# EAGLE design MINI_Sam_2016_10_24_002 (EAGLE 7.6.0)
DESIGNER: BENJAMIN SHOCKLEY; REV: A
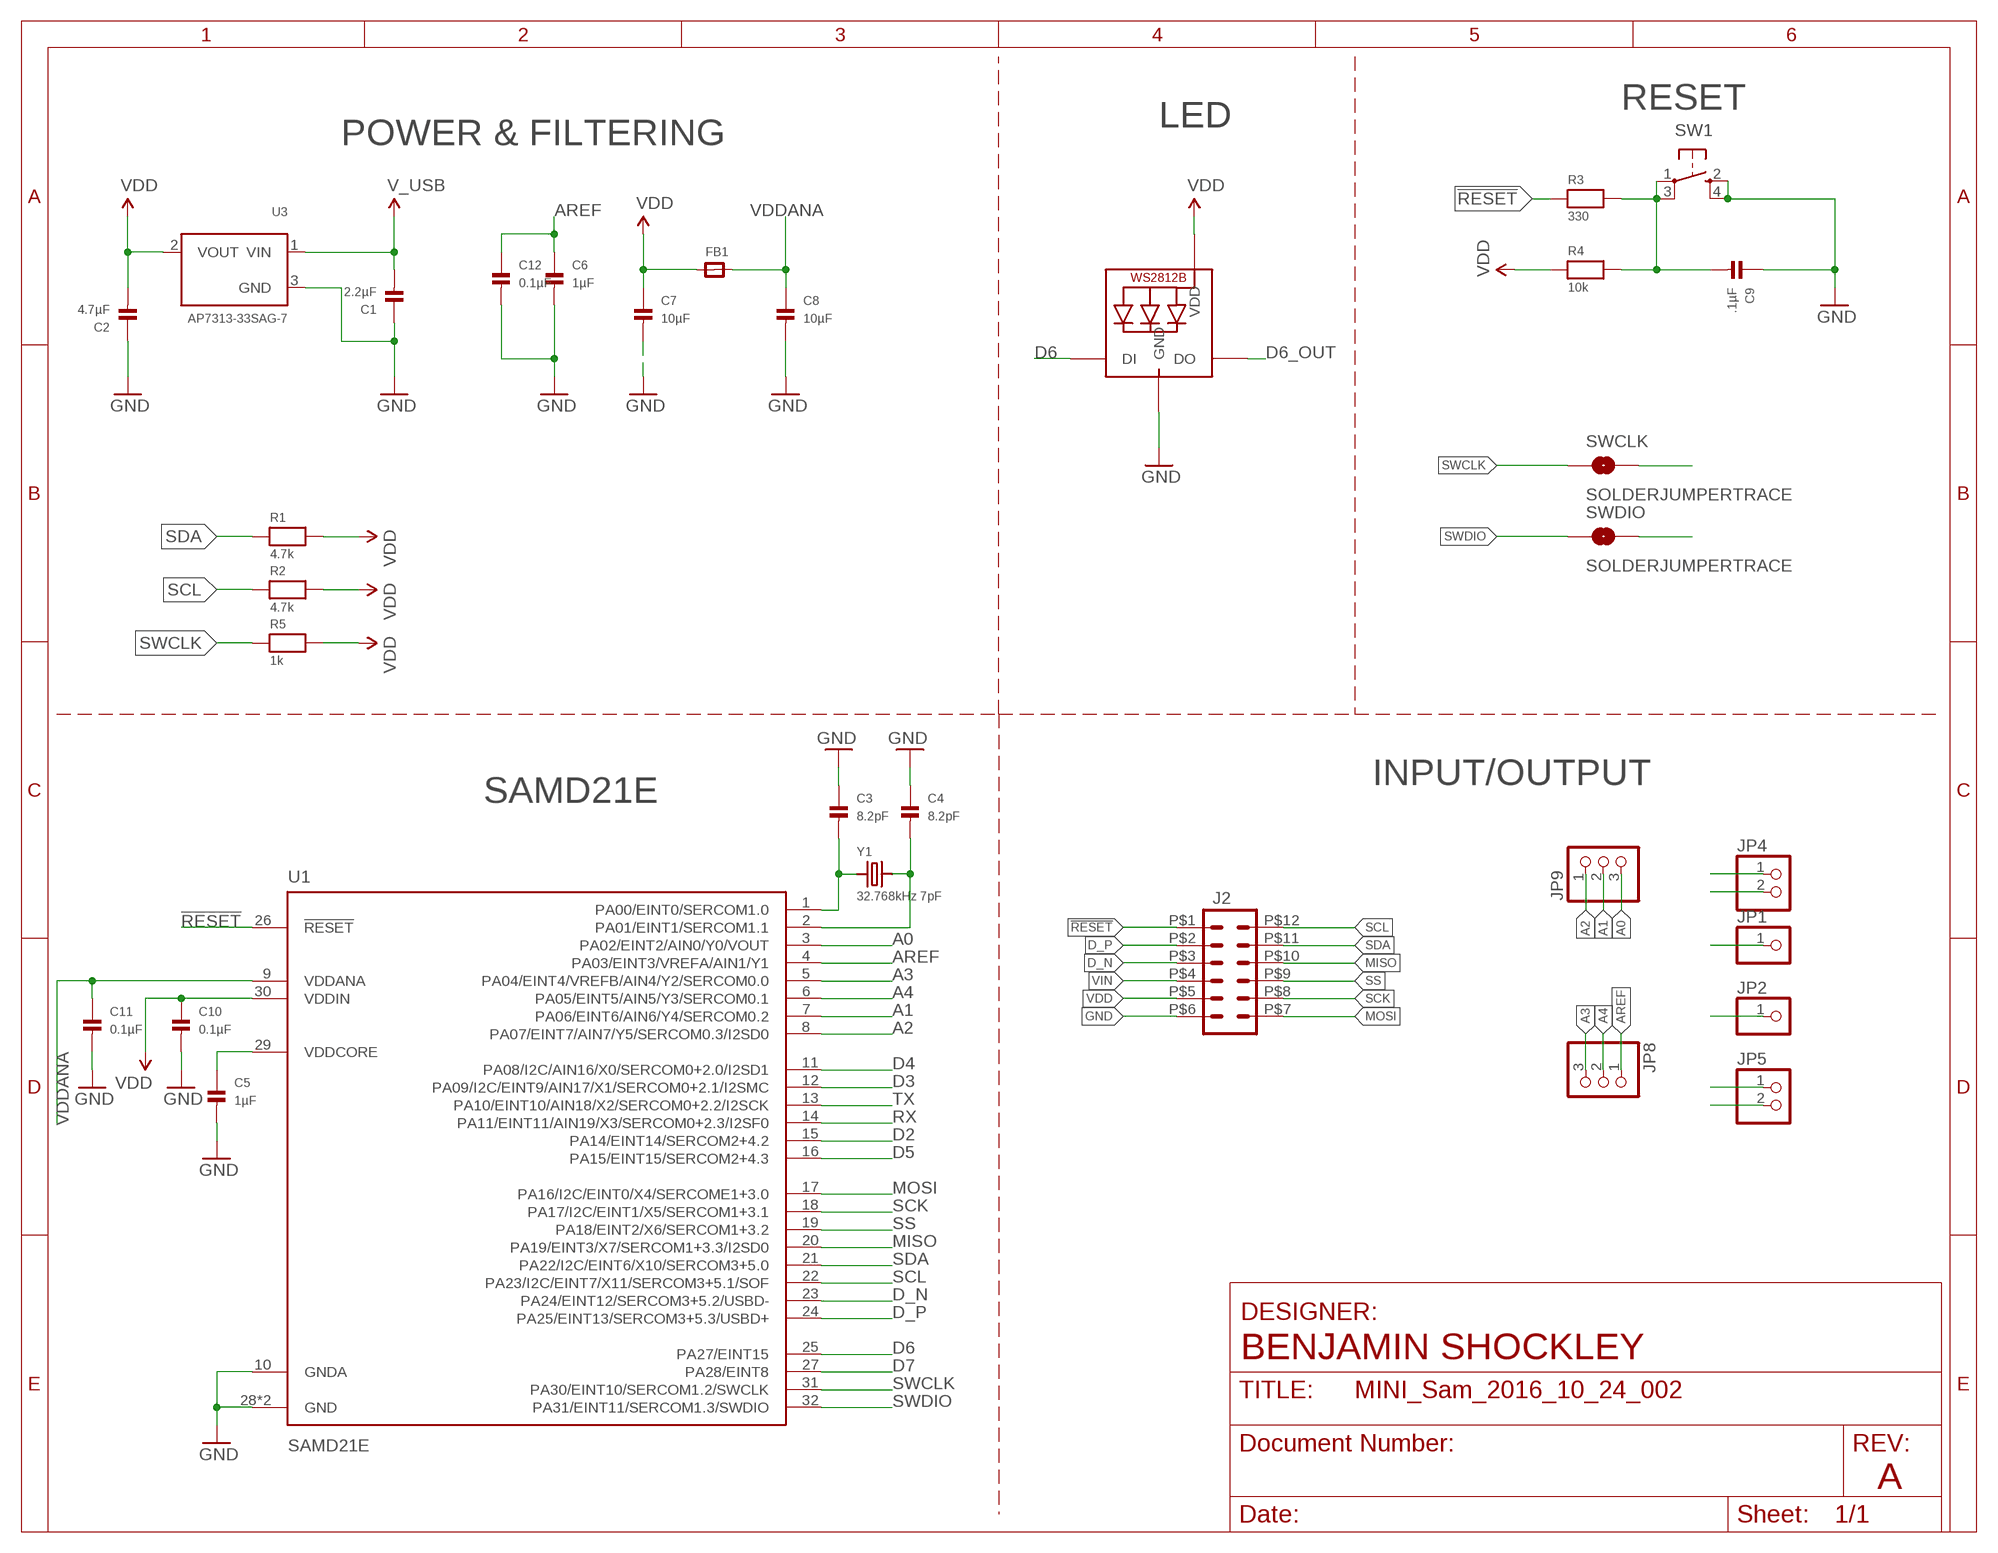
[diagram p0: schematic, sheet 1]

## Parts
C1  2.2µF  CAP_CERAMIC_0805MP  [_0805MP]
C2  4.7µF  CAP_CERAMIC_0805MP  [_0805MP]
C3  8.2pF  CAP_CERAMIC_0805MP  [_0805MP]
C4  8.2pF  CAP_CERAMIC_0805MP  [_0805MP]
C5  1µF  CAP_CERAMIC_0805MP  [_0805MP]
C6  1µF  CAP_CERAMIC_0805MP  [_0805MP]
C7  10µF  CAP_CERAMIC_0805MP  [_0805MP]
C8  10µF  CAP_CERAMIC_0805MP  [_0805MP]
C9  .1µF  CAP_CERAMIC_0805MP  [_0805MP]
C10  0.1µF  CAP_CERAMIC_0805MP  [_0805MP]
C11  0.1µF  CAP_CERAMIC_0805MP  [_0805MP]
C12  0.1µF  CAP_CERAMIC_0805MP  [_0805MP]
FB1  FERRITE_0805MP  [_0805MP]
J2  M06X2  [2MMDUALROW]
JP1  HEADER-1X1ROUND  [1X01_ROUND]
JP2  HEADER-1X1ROUND  [1X01_ROUND]
JP4  HEADER-1X2ROUND  [1X02_ROUND]
JP5  HEADER-1X2ROUND  [1X02_ROUND]
JP8  HEADER-1X3ROUND  [1X03_ROUND]
JP9  HEADER-1X3ROUND  [1X03_ROUND]
LED  WS2812B3535  [LED3535]
R1  4.7k  RESISTOR_0805MP  [_0805MP]
R2  4.7k  RESISTOR_0805MP  [_0805MP]
R3  330  RESISTOR_0805MP  [_0805MP]
R4  10k  RESISTOR_0805MP  [_0805MP]
R5  1k  RESISTOR_0805MP  [_0805MP]
SW1  SPST_TACT-KMR2  [KMR2]
SWCLK  SOLDERJUMPERTRACE  [SJ_2S-TRACE]
SWDIO  SOLDERJUMPERTRACE  [SJ_2S-TRACE]
U1  SAMD21E  [QFN32]
U3  AP7313-33SAG-7  VREG_SOT23  [SOT23-R]
Y1  32.768kHz 7pF  CRYSTAL0805PACKAGE  [_0805MP]

## Nets
!RESET: J2.P$1 R3.1 U1.26(!RESET)
A0: JP9.3 U1.3(PA02/EINT2/AIN0/Y0/VOUT)
A1: JP9.2 U1.7(PA06/EINT6/AIN6/Y4/SERCOM0.2)
A2: JP9.1 U1.8(PA07/EINT7/AIN7/Y5/SERCOM0.3/I2SD0)
A3: JP8.3 U1.5(PA04/EINT4/VREFB/AIN4/Y2/SERCOM0.0)
A4: JP8.2 U1.6(PA05/EINT5/AIN5/Y3/SERCOM0.1)
AREF: C6.1 C12.1 JP8.1 U1.4(PA03/EINT3/VREFA/AIN1/Y1)
D2: JP1.1 U1.15(PA14/EINT14/SERCOM2+4.2)
D3: JP2.1 U1.12(PA09/I2C/EINT9/AIN17/X1/SERCOM0+2.1/I2SMC)
D4: JP5.1 U1.11(PA08/I2C/AIN16/X0/SERCOM0+2.0/I2SD1)
D5: JP5.2 U1.16(PA15/EINT15/SERCOM2+4.3)
D6: LED.1(DI) U1.25(PA27/EINT15)
D6_OUT: LED.3(DO)
D7: U1.27(PA28/EINT8)
D_N [USB_DATA]: J2.P$3 SWDIO.2 U1.23(PA24/EINT12/SERCOM3+5.2/USBD-)
D_P [USB_DATA]: J2.P$2 SWCLK.2 U1.24(PA25/EINT13/SERCOM3+5.3/USBD+)
GND: C1.1 C2.1 C3.1 C4.1 C5.2 C6.2 C7.2 C8.2 C9.1 C10.2 C11.2 C12.2 J2.P$6 LED.4(GND) SW1.2(S) SW1.4(S1) U1.10(GNDA) U1.28(GND) U1.GND U3.3(GND)
MISO: J2.P$10 U1.20(PA19/EINT3/X7/SERCOM1+3.3/I2SD0)
MOSI: J2.P$7 U1.17(PA16/I2C/EINT0/X4/SERCOME1+3.0)
N$1: C3.2 U1.1(PA00/EINT0/SERCOM1.0) Y1.1
N$2: C9.2 R3.2 R4.2 SW1.1(P) SW1.3(P1)
N$5: C4.2 U1.2(PA01/EINT1/SERCOM1.1) Y1.2
N$9: C5.1 U1.29(VDDCORE)
RX: JP4.1 U1.14(PA11/EINT11/AIN19/X3/SERCOM0+2.3/I2SF0)
SCK: J2.P$8 U1.18(PA17/I2C/EINT1/X5/SERCOM1+3.1)
SCL: J2.P$12 R2.1 U1.22(PA23/I2C/EINT7/X11/SERCOM3+5.1/SOF)
SDA: J2.P$11 R1.1 U1.21(PA22/I2C/EINT6/X10/SERCOM3+5.0)
SS: J2.P$9 U1.19(PA18/EINT2/X6/SERCOM1+3.2)
SWCLK: R5.1 SWCLK.1 U1.31(PA30/EINT10/SERCOM1.2/SWCLK)
SWDIO: SWDIO.1 U1.32(PA31/EINT11/SERCOM1.3/SWDIO)
TX: JP4.2 U1.13(PA10/EINT10/AIN18/X2/SERCOM0+2.2/I2SCK)
VDD: C2.2 C7.1 C10.1 FB1.1 J2.P$5 LED.2(VDD) R1.2 R2.2 R4.1 R5.2 U1.30(VDDIN) U3.2(VOUT)
VDDANA: C8.1 C11.1 FB1.2 U1.9(VDDANA)
VIN: C1.2 J2.P$4 U3.1(VIN) ; supply symbol labelled V_USB

## Notes on the sheet
- RESET
- LED
- POWER & FILTERING
- INPUT/OUTPUT
- SAMD21E
- DESIGNER:

## Library data of the parts
C1-C12 = microbuilder:CAP_CERAMIC: Ceramic Capacitors 0402 - 0402 Surface Mount Capacitors 16pF 50V 5% [Digikey: 445-4899-2-ND] 18pF 50V 5% [Digikey: 490-1281-2-ND] 22pF 50V 5% [Digikey: 490-1283-2-ND] 68pF 50V 5% [Digikey: 490-1289-2-ND] 0.1uF 10V 10% [Digikey: 490-1318-2-ND] 1.0uF 6.3V 10% [Digikey: 490-1320-2-ND] 0603 - 0603 Surface Mount Capacitors 16 pF 50V 5% [Digikey: 445-5051-2-ND] 22 pF 50V [Digikey: PCC220ACVTR-ND] 33 pF 50V 5% [Digikey: 490-1415-1-ND] 56pF 50V 5% [Digikey: 490-1421-1-ND] 220pF 50V 5% [Digikey: 445-1285-1-ND] 680 pF 50V 2200 pF 50V 5% C0G [Digikey: 445-1297-1-ND] 5600 pF 100V 5% X7R [Digikey: 478-3711-1-ND] 0.1 µF 25V 10% [Digikey: PCC2277TR-ND] 0.22 µF 16V 10% X7R [Digikey: 445-1318-1-ND] 1.0 µF 25V 10% [Digikey: 445-5146-2-ND] 0603 - RF Specific 3pF 250V +/-0.1pF RF [Digikey: 712-1347-1-ND] 18 pF 250V 5% [Digikey: 478-3505-1-ND or 712-1322-1-ND] 56 pF 250V 5% C0G RF [Digikey: 490-4867-1-ND] 68 pF 250V RF [Digikey: 490-4868-1-ND] 0805 - 0805 Surface Mount Capacitors 220 pF 250V 2% RF Ceramic Capacitor [Digikey: 712-1398-1-ND] 1000 pF 50V 2% NP0 Ceramic Capacitor [Digikey: 478-3760-1-ND] 0.1 µF 25V 10% Ceramic Capacitor [Digikey: PCC1828TR-ND] 1.0 µF 16V 10% Ceramic Capacitor[Digikey: 490-1691-2-ND] 10.0 µF 10V 10% Ceramic Capacitor[Digikey: 709-1228-1-ND] 10.0 uF 16V 10% Ceramic Capacitor [Digikey: 478-5165-2-ND] 47 uF 6.3V 20% Ceramic Capacitor [Digikey: 587-1779-1-ND or 399-5506-1-ND] 1206 - 1206 Surface Mount Capacitors 47uF 10V 20% Ceramic Capacitor [Digikey: 490-5528-1-ND or 399-5508-1-ND or 445-6010-1-ND] 100uF 6.3V -20%, +80% Y5V Ceramic Capacitor (Digikey: 490-4512-1-ND, Mouser: 81-GRM31CF50J107ZE1L)
FB1 = microbuilder:FERRITE: Ferrite Bead 0603 MMZ1608B121C - 120 Ohm @ 100MHz, 600mA, 0.15 Ohm DC Resistance - Digikey: 445-2164-1-ND BK1608HW121-T - 120 Ohm, 600mA Ferrite Chip - Digikey: 587-1876-2-ND 0805 HZ0805B272R-10 - 2.7K Ohm @ 100MHz, 200mA, 0.8 Ohm DC Resistance - Digikey: 240-2504-1-ND (see also Murata BLM21BD272SN1L) MMZ2012Y152B - 1.5K Ohm @ 100MHz, 500mA, 0.4 Ohm DC Resistance - Digikey: 445-1560-1-ND - Mainly for high frequency (80-400MHz) MMZ2012R102A - 1K Ohm @ 100MHz, 500mA, 0.3 Ohm DC Resistance - Digikey: 445-1555-2-ND - More general purpose (10-200MHz)
J2 = Shockley_Custom:M06X2
JP1 JP2 = microbuilder:HEADER-1X1: PIN HEADER
JP4 JP5 = microbuilder:HEADER-1X2: PIN HEADER
JP8 JP9 = microbuilder:HEADER-1X3: PIN HEADER
LED = adafruit:WS2812B
R1-R5 = microbuilder:RESISTOR: Resistors 0402 - 0402 Surface Mount Package 22 Ohm 1% 1/16W [Digikey: 311-22.0LRTR-ND] 33 Ohm 5% 1/16W 1.0K 5% 1/16W 1.5K 5% 1/16W 2.0K 1% 1/16W 10.0K 1% 1/16W [Digikey: 311-10.0KLRTR-ND] 10.0K 5% 1/16W [Digikey: RMCF0402JT10K0TR-ND] 12.1K 1% 1/16W [Digikey: 311-22.0LRTR-ND] 100.0K 5% 1/16W 0603 - 0603 Surface Mount Package 0 Ohm 1/10 Watt 1% Resistor 15 Ohm 1/10 Watt 1% Resistor 33 Ohm 1/10 Watt 1% Resistor 49.9 Ohm 1/10 Watt 1% Resistor 100 Ohm 1/10 Watt 1% Resistor 150 Ohm 1/10 Watt 1% Resistor 240 Ohm 1/10 Watt 1% Resistor 390 Ohm 1/10 Watt 1% Resistor 560 Ohm 1/10 Watt 1% Resistor 680 Ohm 1/10 Watt 1% Resistor 750 Ohm 1/10 Watt 1% Resistor 1.0K Ohm 1/10 Watt 1% Resistor 1.5K Ohm 1/10 Watt 1% Resistor 2.0K Ohm 1/10 Watt 1% Resistor 2.2K Ohm 1/10 Watt 1% Resistor 3.3K Ohm 1/10 Watt 1% Resistor 4.7K Ohm 1/10 Watt 1% Resistor 10.0K Ohm 1/10 Watt 1% Resistor 12.0K Ohm 1/10 Watt 1% Resistor 12.1K Ohm 1/10 Watt 1% Resistor 20.0K Ohm 1/10 Watt 1% Resistor 33.0K Ohm 1/10 Watt 1% Resistor 100.0K Ohm 1/10 Watt 1% Resistor 0805 - 0805 Surface Mount Package 0 Ohm 1/8 Watt 1% Resistor 33 Ohm 1/8 Watt 1% Resistor 100 Ohm 1/8 Watt 1% Resistor 150 Ohm 1/8 Watt 1% Resistor 200 Ohm 1/8 Watt 1% Resistor 240 Ohm 1/8 Watt 1% Resistor 330 Ohm 1/8 Watt 1% Resistor 390 Ohm 1/8 Watt 1% Resistor 470 Ohm 1/8 Watt 1% Resistor 1.0K Ohm 1/8 Watt 1% Resistor 1.5K Ohm 1/8 Watt 1% Resistor 2.0K Ohm 1/8 Watt 1% Resistor 4.7K Ohm 1/8 Watt 1% Resistor 5.1K Ohm 1/8 Watt 1% Resistor 5.6K Ohm 1/8 Watt 1% Resistor 10.0K Ohm 1/8 Watt 1% Resistor 22.0K Ohm 1/8 Watt 1% Resistor 33.0K Ohm 1/8 Watt 1% Resistor 100K Ohm 1/8 Watt 1% Resistor 1206 - 1206 Surface Mount Package 2012 - 2010 Surface Mount Package 0.11 Ohm 1/2 Watt 1% Resistor - Digikey: RHM.11UCT-ND
SW1 = adafruit:SPST_TACT: SMT 6mm switch, EVQQ2 series http://www.ladyada.net/library/eagle
SWCLK SWDIO = SparkFun-Retired:SOLDERJUMPER: Solder Jumper Standard SMD solder jumper. Used to automate production. Two varients : Normally Open and Normally Closed are the same, but have different paste layers. NC will have a large amount of paste and should jumper during reflow.
U1 = Shockley_Custom:SAMD21E
U3 = microbuilder:VREG_SOT23: SOT23 Fixed Voltage Regulators Part Current Out V Out V In V Dropout Digikey Part No. AP7313 150mA 3.3V 3.5-6V 0.15V @ 150mA AP7313-33SAG-7DICT-ND
Y1 = Shockley_Custom:CRYSTAL: Crystals HC49UP - Surface Mount Crystal 4.0MHz 18pF +/-30ppm Surface Mount Crystal [Digikey: 535-9857-1-ND] 12.0 MHz Surface Mount Crystal [Digikey: 535-9869-6-ND] 25.0 MHz Surface Mount Crystal [Digikey: 535-9078-1-ND] 2.5 x 2.0mm - MEMs SMT Crystal 16.0 MHz 10pF 20ppm 2.5 x 2.0mm Crystal [Digikey -40-85°C: 535-10923-1-ND] 3.2 x 2.5mm - MEMs SMT Crystal 12.0 MHz 8pF 15ppm 3.2 x 2.5mm Crystal [Digikey: -10-70°C: 644-1047-1-ND -40-125°C: 644-1128-1-ND] 16.0 MHz 8pF 15ppm 3.2 x 2.5mm Crystal [Digikey: -10-70°C: 644-1049-1-ND -40-125°C: 644-1129-2-ND] 16.0 MHz 10pF 10ppm 3.2 x 2.5mm Crystal [Digikey: 644-1100-1-ND] 27.12 MHz 18pF 30ppm 3.2 x 2.5mm Crystal [Digikey: 887-1424-1-ND] 27.12MHz 10pF 10ppm 3.2 x 2.5mm Crystal [Digikey: 887-1329-1-ND] 4.9 x 1.8mm - MEMs SMT Crystal 32.768 KHz 12.5pF 20ppm 4.9 x 1.8mm Crystal [Digikey: SE2415CT-ND] 8.0 x 3.8mm - Surface Mount Crystal 32.768kHz 12.5pF 20ppm -40°C-85°C [Digikey: 535-9166-2-ND] Cylinder 32.768KHz Cylinder Crystal (2x6mm body) [Ex. Digikey: 300-8341-2-ND]

## Board
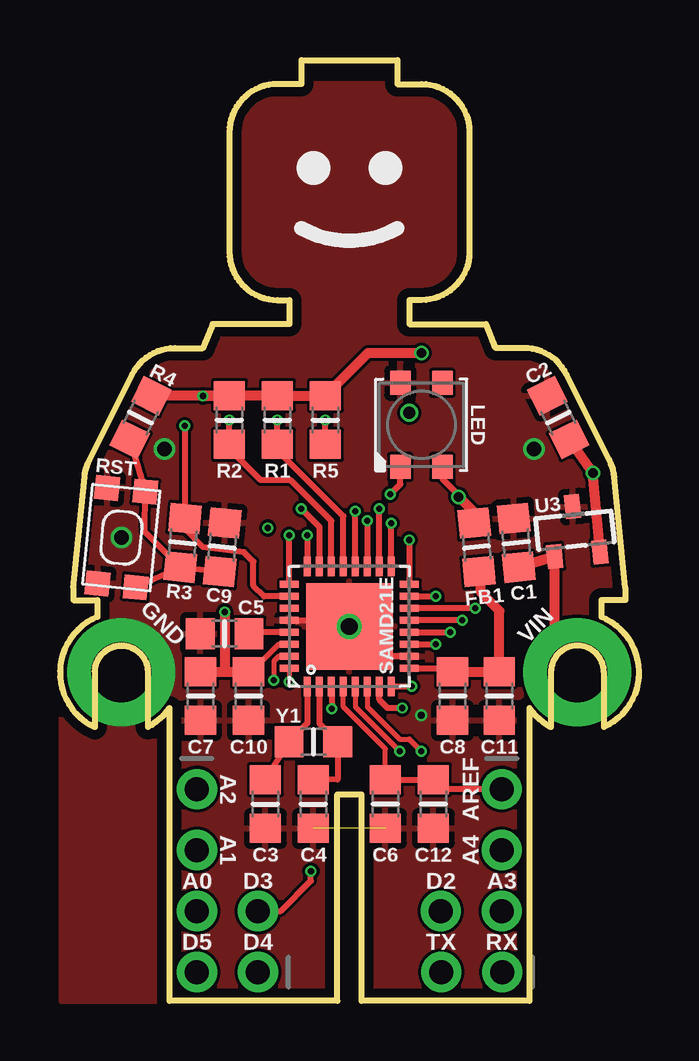
[diagram p1: board, top side]
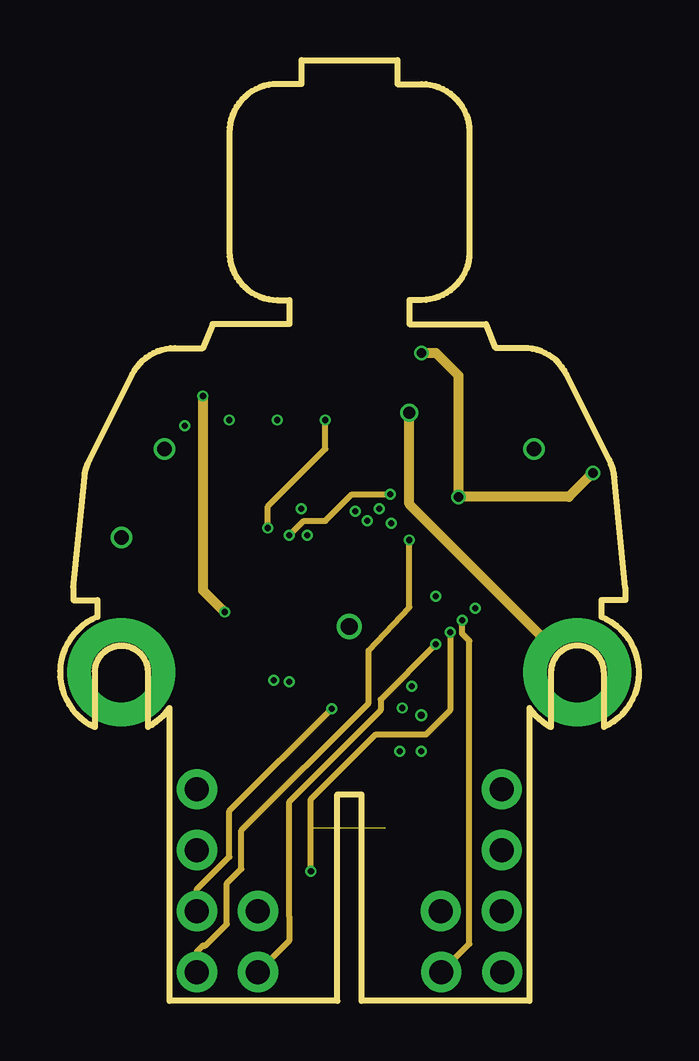
[diagram p2: board, inner layer Route2]
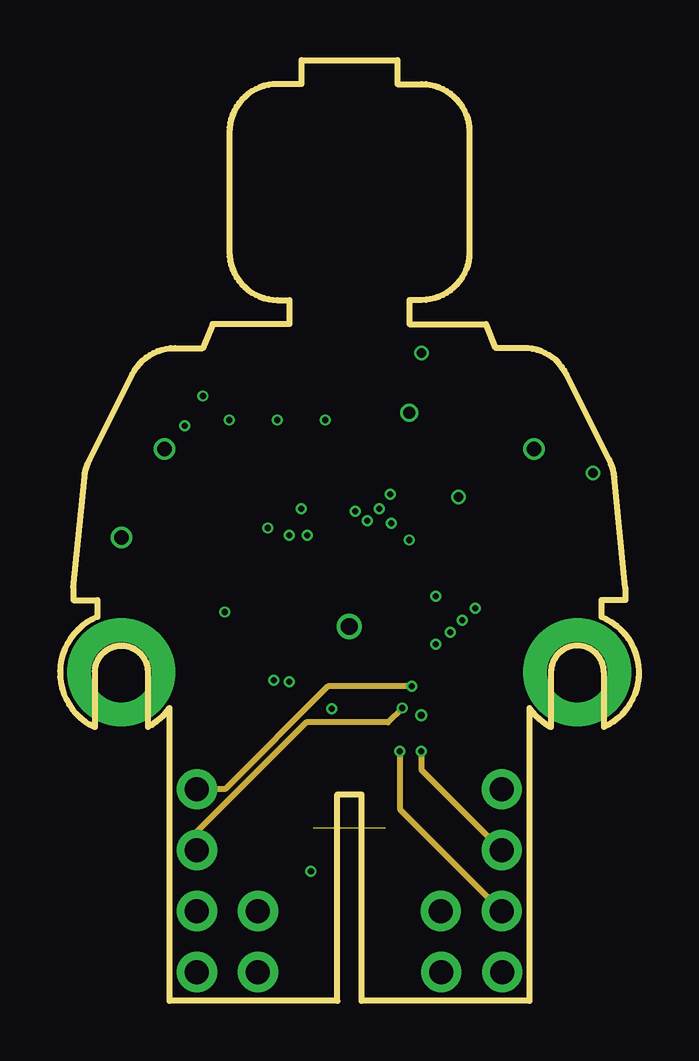
[diagram p3: board, inner layer Route15]
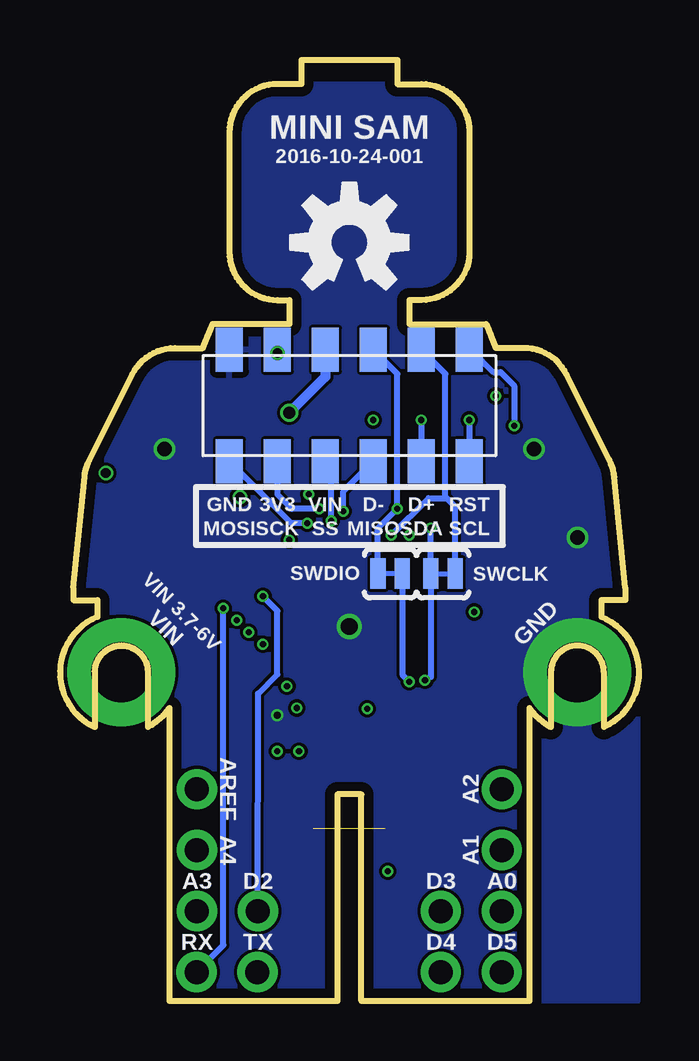
[diagram p4: board, bottom side, seen from below]

Size 24.12 x 39.2 mm. Coordinates in mm from the lower left corner, seen from the top.
Outline: 10.06,39.2 14.06,39.2 14.06,38.2 15.06,38.2 arc-90 17.06,36.2 17.06,31.2 arc-90 15.06,29.2 14.56,29.2 14.56,28.2 17.76,28.2 18.16,27.2 19.32,27.2 arc-63 21.11,26.09 22.89,22.53 arc-21 23.09,21.83 23.56,17.2 23.56,16.7 22.56,16.7 22.56,16 arc-133 22.66,11.4 22.66,13.7 arc180 20.46,13.7 20.46,11.4 arc-28 19.56,12.2 19.56,0 12.56,0 12.56,8.6 11.56,8.6 11.56,0 4.56,0 4.56,12.2 arc-28 3.66,11.4 3.66,13.7 arc180 1.46,13.7 1.46,11.4 arc-133 1.56,16 1.56,16.7 0.56,16.7 0.56,17.2 1.02,21.83 arc-21 1.22,22.53 3,26.09 arc-63 4.79,27.2 5.96,27.2 6.36,28.2 9.56,28.2 9.56,29.2 9.06,29.2 arc-90 7.06,31.2 7.06,36.2 arc-90 9.06,38.2 10.06,38.2 10.06,39.2
Copper layers (1*2*15*16): Top 0.035559375mm / dielectric 0.17018125mm / Route2 0.01778125mm / dielectric 47mil / Route15 0.01778125mm / dielectric 0.17018125mm / Bottom 0.035559375mm
Design rules "OSHPark-4layer": minimum track width 5mil, minimum drill 10mil, track to track 5mil, track to pad 5mil, pad to pad 5mil, via to via 5mil, smd to smd 5mil, copper to edge 15mil, drill to drill 6mil, minimum pad ring 4mil, minimum via ring 4mil, stop-mask expansion 2.5mil, vias tented up to drill 0mil, thermal gap 10mil

### Footprints (pad centres in the part's own frame; a part is rotated, then mirrored left to right if it is on the bottom)
_0805MP = smd 1.2 x 1.3: 1 -1.016,0; 2 1.016,0
2MMDUALROW = smd 1.118 x 1.829: P$1 -5,-2.325; P$2 -3,-2.325; P$3 -1,-2.325; P$4 1,-2.325; P$5 3,-2.325; P$6 5,-2.325; P$7 5,2.325; P$8 3,2.325; P$9 1,2.325; P$10 -1,2.325; P$11 -3,2.325; P$12 -5,2.325
1X01_ROUND = drill 1 pad 1.676: 1 0,0
1X02_ROUND = drill 1 pad 1.676: 1 -1.27,0; 2 1.27,0
1X03_ROUND = drill 1 pad 1.676: 1 -2.54,0; 2 0,0; 3 2.54,0
LED3535 = smd 1 x 0.85: 1 -1.75,0.875; 2 -1.75,-0.875; 3 1.75,-0.875; 4 1.75,0.875
KMR2 = smd 1 x 1: 1 2,0.8; 2 2,-0.8; 3 -2,0.8; 4 -2,-0.8
SJ_2S-TRACE = smd 0.635 x 1.27: 1 -0.508,0; 2 0.508,0
QFN32 = smd 0.8 x 0.285: 1 -2.5,1.75; 2 -2.5,1.25; 3 -2.5,0.75; 4 -2.5,0.25; 5 -2.5,-0.25; 6 -2.5,-0.75; 7 -2.5,-1.25; 8 -2.5,-1.75; 17 2.5,-1.75; 18 2.5,-1.25; 19 2.5,-0.75; 20 2.5,-0.25; 21 2.5,0.25; 22 2.5,0.75; 23 2.5,1.25; 24 2.5,1.75 | smd 0.285 x 0.8: 9 -1.75,-2.5; 10 -1.25,-2.5; 11 -0.75,-2.5; 12 -0.25,-2.5; 13 0.25,-2.5; 14 0.75,-2.5; 15 1.25,-2.5; 16 1.75,-2.5; 25 1.75,2.5; 26 1.25,2.5; 27 0.75,2.5; 28 0.25,2.5; 29 -0.25,2.5; 30 -0.75,2.5; 31 -1.25,2.5; 32 -1.75,2.5 | smd 3.6 x 3.6: GND 0,0
SOT23-R = smd 0.635 x 1.016: 1 -0.95,-1; 2 0.95,-1; 3 0,1

### Placement (x,y rotation side)
C1  19.01,19.08 275.7 top
C2  20.76,24.3 296.5 top
C3  8.56,8.2 90 top
C4  10.56,8.2 90 top
C5  6.86,15.3 180 top
C6  13.56,8.2 270 top
C7  5.86,12.7 270 top
C8  16.36,12.7 270 top
C9  6.76,18.9 264.3 top
C10  7.86,12.7 270 top
C11  18.31,12.7 270 top
C12  15.56,8.2 270 top
FB1  17.36,18.9 275.7 top
J2  12.06,24.8 180 bottom
JP1  15.87,3.74 0 top
JP2  8.25,3.74 0 top
JP4  17.16,1.2 180 top
JP5  6.98,1.2 180 top
JP8  18.41,6.28 270 top
JP9  5.71,6.28 270 top
LED  15.06,24 90 top
R1  9.06,24.2 90 top
R2  7.06,24.2 90 top
R3  5.11,19.08 264.3 top
R4  3.36,24.3 243.5 top
R5  11.06,24.2 90 top
SW1  2.56,19.3 264.3 top
SWCLK  8.16,17.8 0 bottom
SWDIO  10.36,17.8 180 bottom
U1  12.06,15.6 90 top
U3  21.46,19.6 5.7 top
U$1  [OSHW-LOGO-M]  12.06,31.6 0 bottom
Y1  10.55,10.8 0 top

### Tracks (layer width: path | path; a pad name or v marks a point on that pad's centre or on a via)
!RESET  (via drill 0.25)
  Top 0.254: U1.26 8.51,16.85 8.06,17.3 8.06,18.3 7.66,18.7 5.96,18.9 5.21,19.65 R3.1 5.21,23.98 v5.2,23.96
  Bottom 0.254: J2.P$1 6.98,27.12 6.06,26.2 5.76,26.2 5.2,25.64 v5.2,23.96
A0  (via drill 0.25)
  Top 0.254: U1.3 v11.31,12.17
  Route2 0.254: JP9.3 5.71,4.65 7.06,6 7.06,7.91 v11.31,12.17
A1  (via drill 0.25)
  Top 0.254: v14.26,12.2 13.66,12.2 13.31,12.55 U1.7
  Route15 0.254: v14.26,12.2 13.66,11.6 10.26,11.6 5.71,7.05 JP9.2
A2  (via drill 0.25)
  Top 0.254: U1.8 v14.66,13.1
  Route15 0.254: v14.66,13.1 11.16,13.1 6.88,8.82 JP9.1
A3  (via drill 0.25)
  Top 0.203: U1.5 12.31,12.25 v14.16,10.4
  Route15 0.254: v14.16,10.4 14.16,7.99 JP8.3
A4  (via drill 0.25)
  Top 0.203: U1.6 12.81,12.25 14.16,10.9 14.56,10.9 v15.06,10.4
  Route15 0.254: v15.06,10.4 15.06,9.63 JP8.2
AREF
  Top 0.203: C6.1 13.56,10.5 11.81,12.25 U1.4
  Top 0.254: C6.1 C12.1 15.75,8.82 JP8.1
D2  (via drill 0.25)
  Top 0.254: U1.15 v15.66,16.85
  Bottom 0.254: v15.66,16.85 15.06,16.25 15.06,13.6 15.86,12.8 JP1.1
D3  (via drill 0.25)
  Top 0.254: U1.12 v16.26,15.35 | JP2.1 9.2,3.74 10.46,5 v10.46,5.4
  Route2 0.254: v16.26,15.35 16.26,12.1 15.26,11.1 13.16,11.1 10.46,8.4 v10.46,5.4
D4  (via drill 0.25)
  Top 0.254: U1.11 v15.66,14.85
  Route2 0.254: v15.66,14.85 13.36,12.55 13.36,12.1 9.56,8.3 9.56,3.5 9.55,2.5 JP5.1
D5  (via drill 0.25)
  Top 0.254: v14.56,19.2 U1.16
  Route2 0.254: JP5.2 5.71,2.05 5.96,2.3 6.06,2.3 6.96,3.2 6.96,4.9 7.56,5.5 7.56,7.1 12.86,12.4 12.86,14.6 14.56,16.4 v14.56,19.2
D6  (via drill 0.25)
  Top 0.254: U1.25 v9.56,19.4 | v13.76,21.1 14.18,21.52 LED.1
  Route2 0.254: v9.56,19.4 10.16,20 11.06,20 12.16,21.1 v13.76,21.1
D_N  (via drill 0.25)
  Top 0.254: v10.06,20.5 10.81,19.75 U1.23
  Bottom 0.254: J2.P$3 10.06,26.12 v10.06,20.5 10.87,19.69 SWDIO.2
D_P  (via drill 0.25)
  Top 0.254: v10.31,19.4 U1.24
  Bottom 0.254: 8.06,21 8.06,20.95 8.76,20.95 v10.31,19.4 | 8.06,21 8.06,26.12 J2.P$2 | SWCLK.2 7.65,20.59 8.06,21
GND  (via drill 0.3, 0.6, 0.7, 2.5 pad 4.5)  (1 unrouted)
  Top 0.254: U1.10 13.31,14.35 U1.GND | 11.36,14.9 U1.GND | U1.28 11.81,15.85 U1.GND
  other vias: 2.56,13.7 2.56,19.3 15.06,11.9 12.06,15.6 19.76,23 4.36,23
  pour Top: 0.06,0 24.06,0 24.06,38.2 0.06,38.2
  pour Bottom: 0.06,0 24.06,0 24.06,38.2 0.06,38.2
  pour Top: 4.86,16 4.86,13.81 arc-90 2.35,11.3 2.05,11.3 arc-90 -0.14,13.49 arc-90 2.37,16
MISO  (via drill 0.25)
  Top 0.254: U1.20 v12.31,20.4
  Bottom 0.254: v12.31,20.4 12.31,21.23 J2.P$10
MOSI  (via drill 0.25)
  Top 0.254: U1.17 v13.81,19.9
  Bottom 0.254: v13.81,19.9 14.48,19.9 J2.P$7
N$1
  Top 0.254: U1.1 10.31,11.57 Y1.1 9.56,10.78 C3.2
N$2
  Top 0.254: R3.2 C9.2 | R3.2 SW1.1 | R4.2 SW1.3 3.54,19.54 R3.2
N$5
  Top 0.254: U1.2 10.81,11.56 Y1.2 11.57,9.23 C4.2
N$9
  Top 0.254: U1.29 7.87,15.35 C5.1
RX  (via drill 0.25)
  Top 0.254: v17.31,16.35 U1.14
  Bottom 0.254: v17.31,16.35 17.31,2.32 JP4.1
SCK  (via drill 0.25)
  Top 0.254: U1.18 v13.31,20.5
  Bottom 0.254: J2.P$8 15.06,21.1 14.46,20.5 v13.31,20.5
SCL  (via drill 0.25)
  Top 0.254: U1.22 11.31,20 9.61,21.7 8.36,21.7 7.06,23 R2.1 v7.06,24.2
  Bottom 0.254: v7.06,24.2 J2.P$12
SDA  (via drill 0.25)
  Top 0.254: U1.21 11.81,20.2 9.06,22.95 R1.1 v9.06,24.2
  Bottom 0.254: v9.06,24.2 J2.P$11
SS  (via drill 0.25)
  Top 0.254: v12.81,20 U1.19
  Bottom 0.254: v12.81,20 12.81,22.23 J2.P$9
SWCLK  (via drill 0.25)
  Top 0.203: U1.31 9.11,14.35 8.91,14.15 v8.91,13.35
  Top 0.254: R5.1 v11.06,24.2
  Route2 0.254: v8.66,19.7 8.66,20.6 11.06,23 v11.06,24.2
  Bottom 0.254: v8.91,13.35 8.67,13.49 SWCLK.1 v8.66,19.7
SWDIO  (via drill 0.25)
  Top 0.203: U1.32 v9.56,13.3
  Bottom 0.254: v9.55,13.31 v9.56,13.3 9.85,13.59 SWDIO.1
TX  (via drill 0.25)
  Top 0.254: v16.76,15.85 U1.13
  Route2 0.254: JP4.2 17.06,2.37 17.06,15 16.76,15.3 v16.76,15.85
VDD  (via drill 0.25, 0.4)
  Top 0.203: U1.30 9.11,14.85 7.97,13.72
  Top 0.254: 7.84,13.7 C10.1 7.97,13.72 | 7.05,25.21 R2.2 7.04,25.2 | 16.61,21.07 15.93,21.75 LED.2
  Top 0.406: v6.86,16.2 6.86,13.72 | 6.86,13.72 C10.1 | C7.1 6.86,13.72 | R2.2 R1.2 R5.2 12.84,27 v15.06,27 | 7.05,25.21 R4.1 | 7.04,25.2 v5.96,25.2 | FB1.1 17.26,20.35 v16.61,21 16.61,21.07 | C2.2 v22.21,22 U3.2
  Route2 0.406: v15.06,27 15.66,27 16.61,26.05 v16.61,21 21.21,21 v22.21,22 | v5.96,25.2 5.96,17.1 v6.86,16.2
  Bottom 0.254: J2.P$5 v15.06,27
VDDANA
  Top 0.254: U1.9 16.22,13.85 C8.1
  Top 0.406: C8.1 C11.1 18.31,16.25 17.56,17 FB1.2
VIN  (via drill 0.5, 2.5 pad 4.5)
  Top 0.406: v21.56,13.7 20.61,14.65 U3.1 C1.2
  Route2 0.406: v21.56,13.7 14.56,20.7 v14.56,24.5
  Bottom 0.406: J2.P$4 13.06,26 v14.56,24.5

### Text on the board
tPlace: GND | VIN
tNames: RST | A2 | AREF | A1 | A4 | A0 | D3 | D2 | A3 | D5 | D4 | TX | RX
bNames: MINI SAM | 2016-10-24-001 | RST | D+ | D- | VIN | 3V3 | GND | SCL | SDA | MISO | SS | SCK | MOSI | GND | VIN 3.7-6V | VIN | A2 | AREF | A1 | A4 | A0 | D3 | D2 | A3 | D5 | D4 | TX | RX